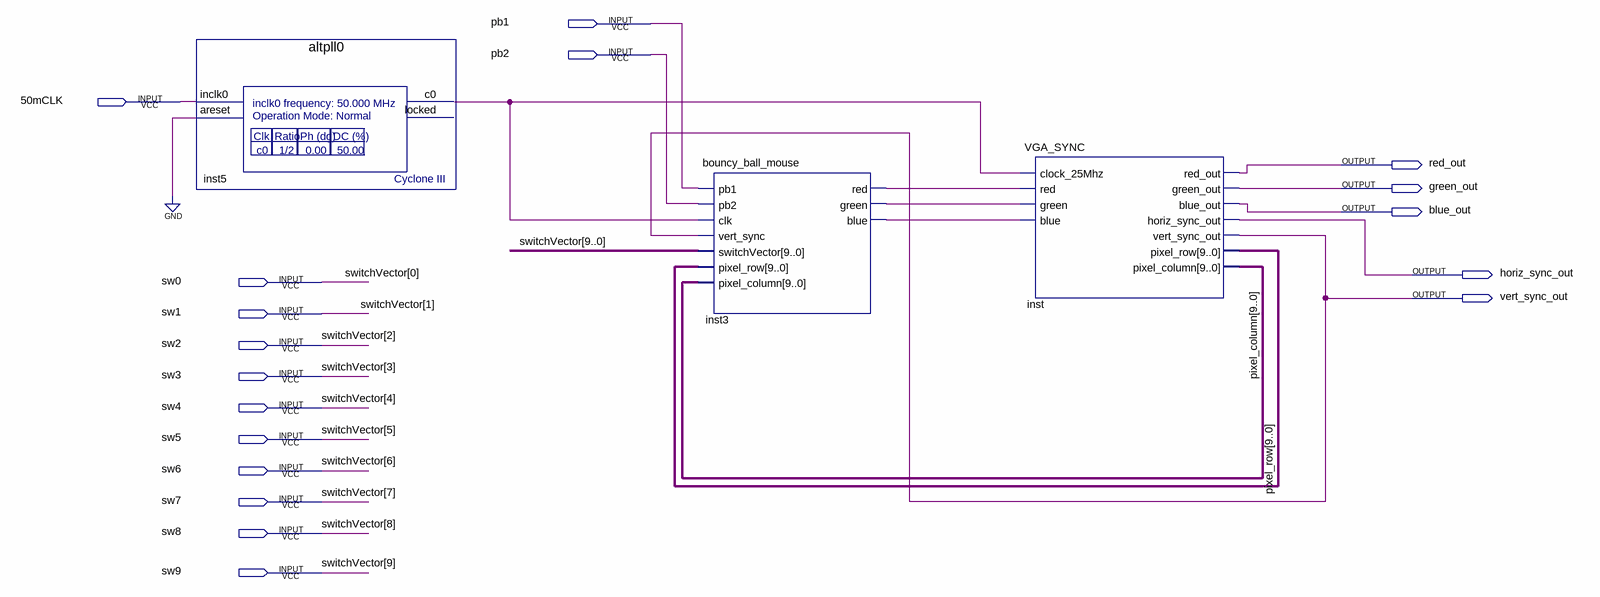
[diagram p0: schematic sheet]
// Quartus schematic uProject.bdf as structural Verilog: 3 symbols, 18 pins
module uProject (
  input  pb1,
  input  pb2,
  input  \50mCLK ,
  input  sw0,
  input  sw1,
  input  sw2,
  input  sw3,
  input  sw4,
  input  sw5,
  input  sw6,
  input  sw7,
  input  sw8,
  input  sw9,
  output red_out,
  output green_out,
  output blue_out,
  output horiz_sync_out,
  output vert_sync_out
);

  wire inst3_blue, inst3_green, inst3_red, inst5_c0;
  wire [9:0] pixel_column, pixel_row;

  altpll0 inst5 (.inclk0(\50mCLK ), .areset(1'b0), .c0(inst5_c0));  // open: locked
  bouncy_ball_mouse inst3 (
    .pb1(pb1), .pb2(pb2), .clk(inst5_c0), .vert_sync(vert_sync_out),
    .switchVector({sw9, sw8, sw7, sw6, sw5, sw4, sw3, sw2, sw1, sw0}), .pixel_row(pixel_row),
    .pixel_column(pixel_column), .red(inst3_red), .green(inst3_green), .blue(inst3_blue));
  VGA_SYNC inst (
    .clock_25Mhz(inst5_c0), .red(inst3_red), .green(inst3_green), .blue(inst3_blue), .red_out(red_out),
    .green_out(green_out), .blue_out(blue_out), .horiz_sync_out(horiz_sync_out),
    .vert_sync_out(vert_sync_out), .pixel_row(pixel_row), .pixel_column(pixel_column));

  // Other names for the same wires on the sheet: switchVector[9:0] = {sw9, sw8, sw7, sw6, sw5, sw4, sw3, sw2, sw1, sw0}
endmodule
